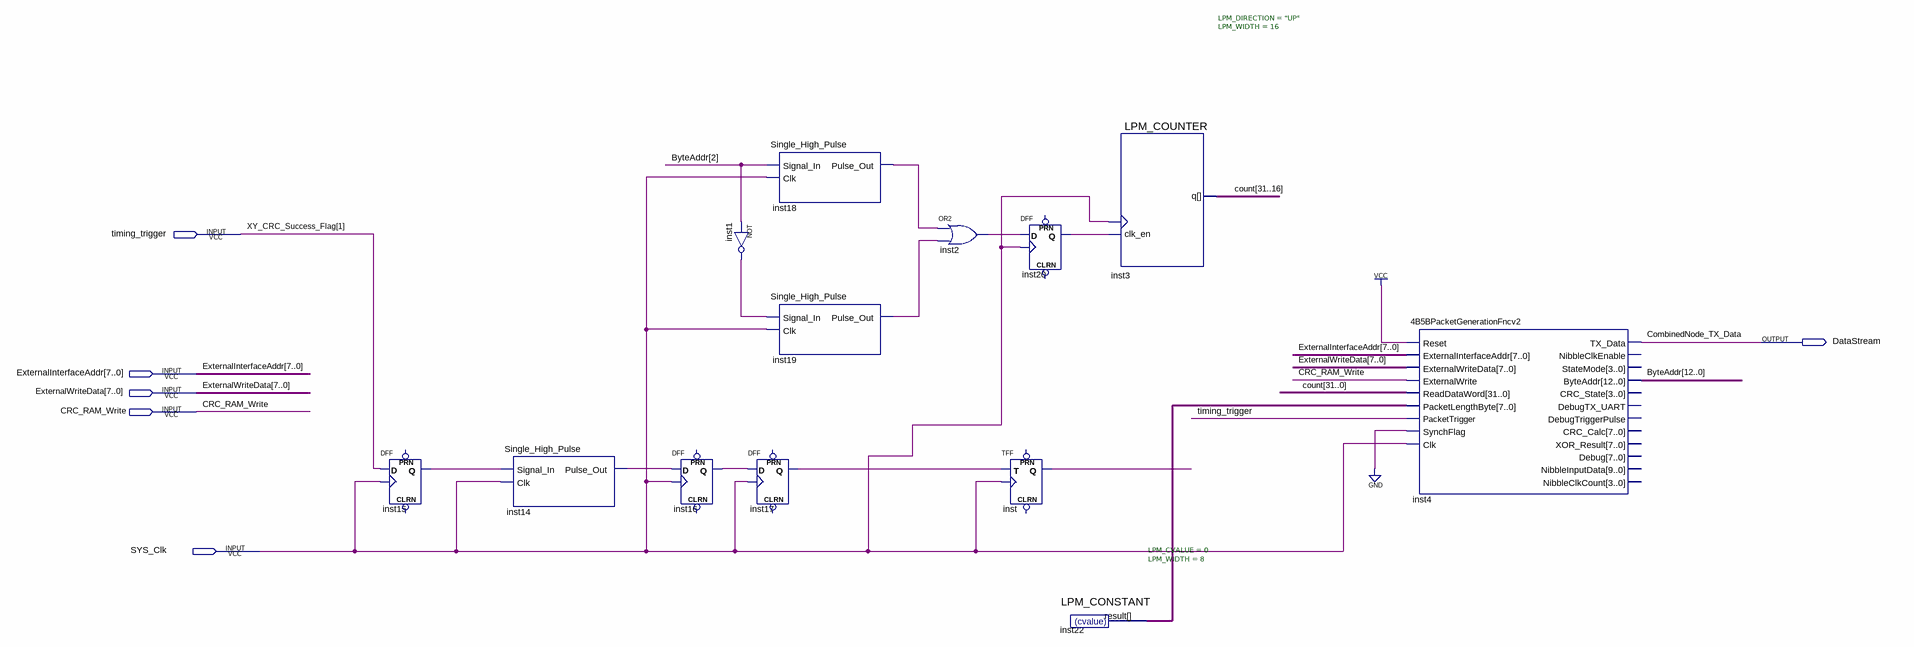
[diagram p0: schematic sheet]
// Quartus schematic TempFIFO_Stream.bdf as structural Verilog: 13 symbols, 6 pins
module TempFIFO_Stream (
  input  timing_trigger,
  input  [7:0] ExternalInterfaceAddr,
  input  [7:0] ExternalWriteData,
  input  CRC_RAM_Write,
  input  SYS_Clk,
  output DataStream
);

  wire inst1_out, inst2_out, inst14_pulse_out, inst15_q, inst16_q, inst17_q, inst18_pulse_out,
       inst19_pulse_out, inst20_q, inst_q;
  wire [7:0] inst22_result;
  wire [12:0] ByteAddr;
  wire [31:0] count;

  DFF inst15 (.CLK(SYS_Clk), .D(timing_trigger), .Q(inst15_q));  // open: CLRN, PRN
  Single_High_Pulse inst14 (.Signal_In(inst15_q), .Clk(SYS_Clk), .Pulse_Out(inst14_pulse_out));
  DFF inst16 (.CLK(SYS_Clk), .D(inst14_pulse_out), .Q(inst16_q));  // open: CLRN, PRN
  not inst1 (inst1_out, ByteAddr[2]);
  Single_High_Pulse inst18 (.Signal_In(ByteAddr[2]), .Clk(SYS_Clk), .Pulse_Out(inst18_pulse_out));
  Single_High_Pulse inst19 (.Signal_In(inst1_out), .Clk(SYS_Clk), .Pulse_Out(inst19_pulse_out));
  DFF inst17 (.CLK(SYS_Clk), .D(inst16_q), .Q(inst17_q));  // open: CLRN, PRN
  or inst2 (inst2_out, inst18_pulse_out, inst19_pulse_out);
  DFF inst20 (.CLK(SYS_Clk), .D(inst2_out), .Q(inst20_q));  // open: CLRN, PRN
  TFF inst (.T(inst17_q), .CLK(SYS_Clk), .Q(inst_q));  // open: PRN, CLRN
  LPM_CONSTANT #(.LPM_CVALUE(0), .LPM_WIDTH(8)) inst22 (.result(inst22_result));
  LPM_COUNTER #(.LPM_DIRECTION("UP"), .LPM_WIDTH(16)) inst3 (.clk_en(inst20_q), .clock(SYS_Clk), .q(count[31:16]));
  \4B5BPacketGenerationFncv2  inst4 (
    .Reset(1'b1), .ExternalInterfaceAddr(ExternalInterfaceAddr), .ExternalWriteData(ExternalWriteData),
    .ExternalWrite(CRC_RAM_Write), .ReadDataWord(count), .PacketLengthByte(inst22_result),
    .PacketTrigger(timing_trigger), .SynchFlag(1'b0), .Clk(SYS_Clk), .TX_Data(DataStream), .ByteAddr(ByteAddr));  // open: NibbleClkEnable, StateMode, CRC_State, DebugTX_UART, DebugTriggerPulse, CRC_Calc, XOR_Result, Debug, NibbleInputData, NibbleClkCount

  // Other names for the same wires on the sheet: CombinedNode_TX_Data = DataStream;
  //   XY_CRC_Success_Flag[1] = timing_trigger
endmodule
